# Altium schematic sheet GTM_RightJawGrippersMotorConnector.SchDoc
size A4
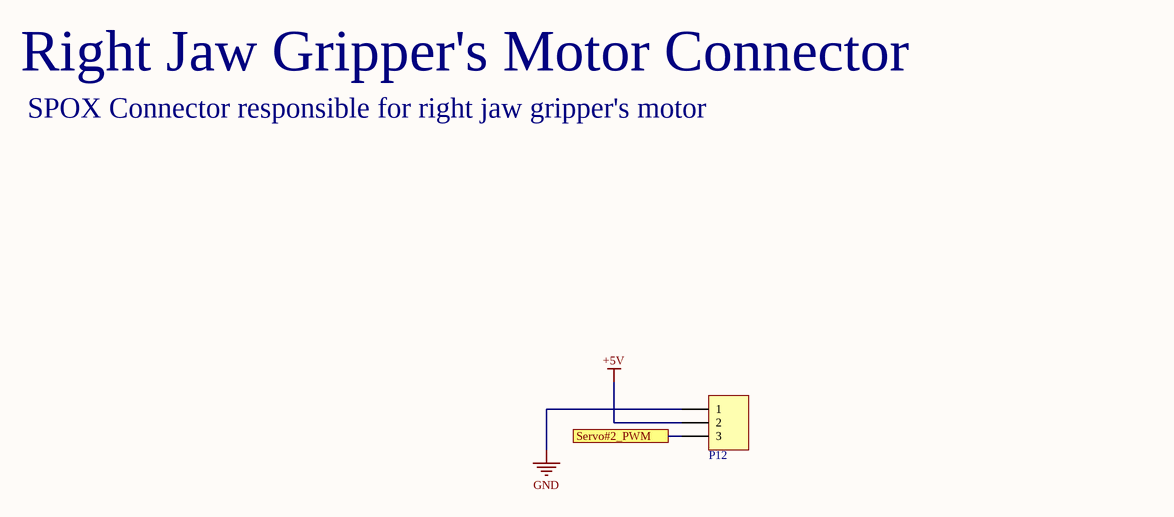
[diagram p0: GTM_RightJawGrippersMotorConnector.SchDoc]

## Parts
P12  HDR1X3  [Molex SPOX Horizontal 3 Circuits]  (value not drawn)

## Ports
Servo#2_PWM

## Nets
+5V: P12.2
GND: P12.1
Servo#2_PWM: P12.3 ; port Servo#2_PWM

## Notes on the sheet
- Right Jaw Gripper's Motor Connector
- SPOX Connector responsible for right jaw gripper's motor
- Project
- Rev.
- Title
- Drawn by
- Date
- Sheet
- of
- Checked by

## Library data of the parts
P12 = HDR1X3: Header, 3-Pin; LatestRevisionDate: 17-Jul-2002; LatestRevisionNote: Re-released for DXP Platform.; Publisher: Altium Limited